# EAGLE design edlinv (EAGLE 7.4.0)
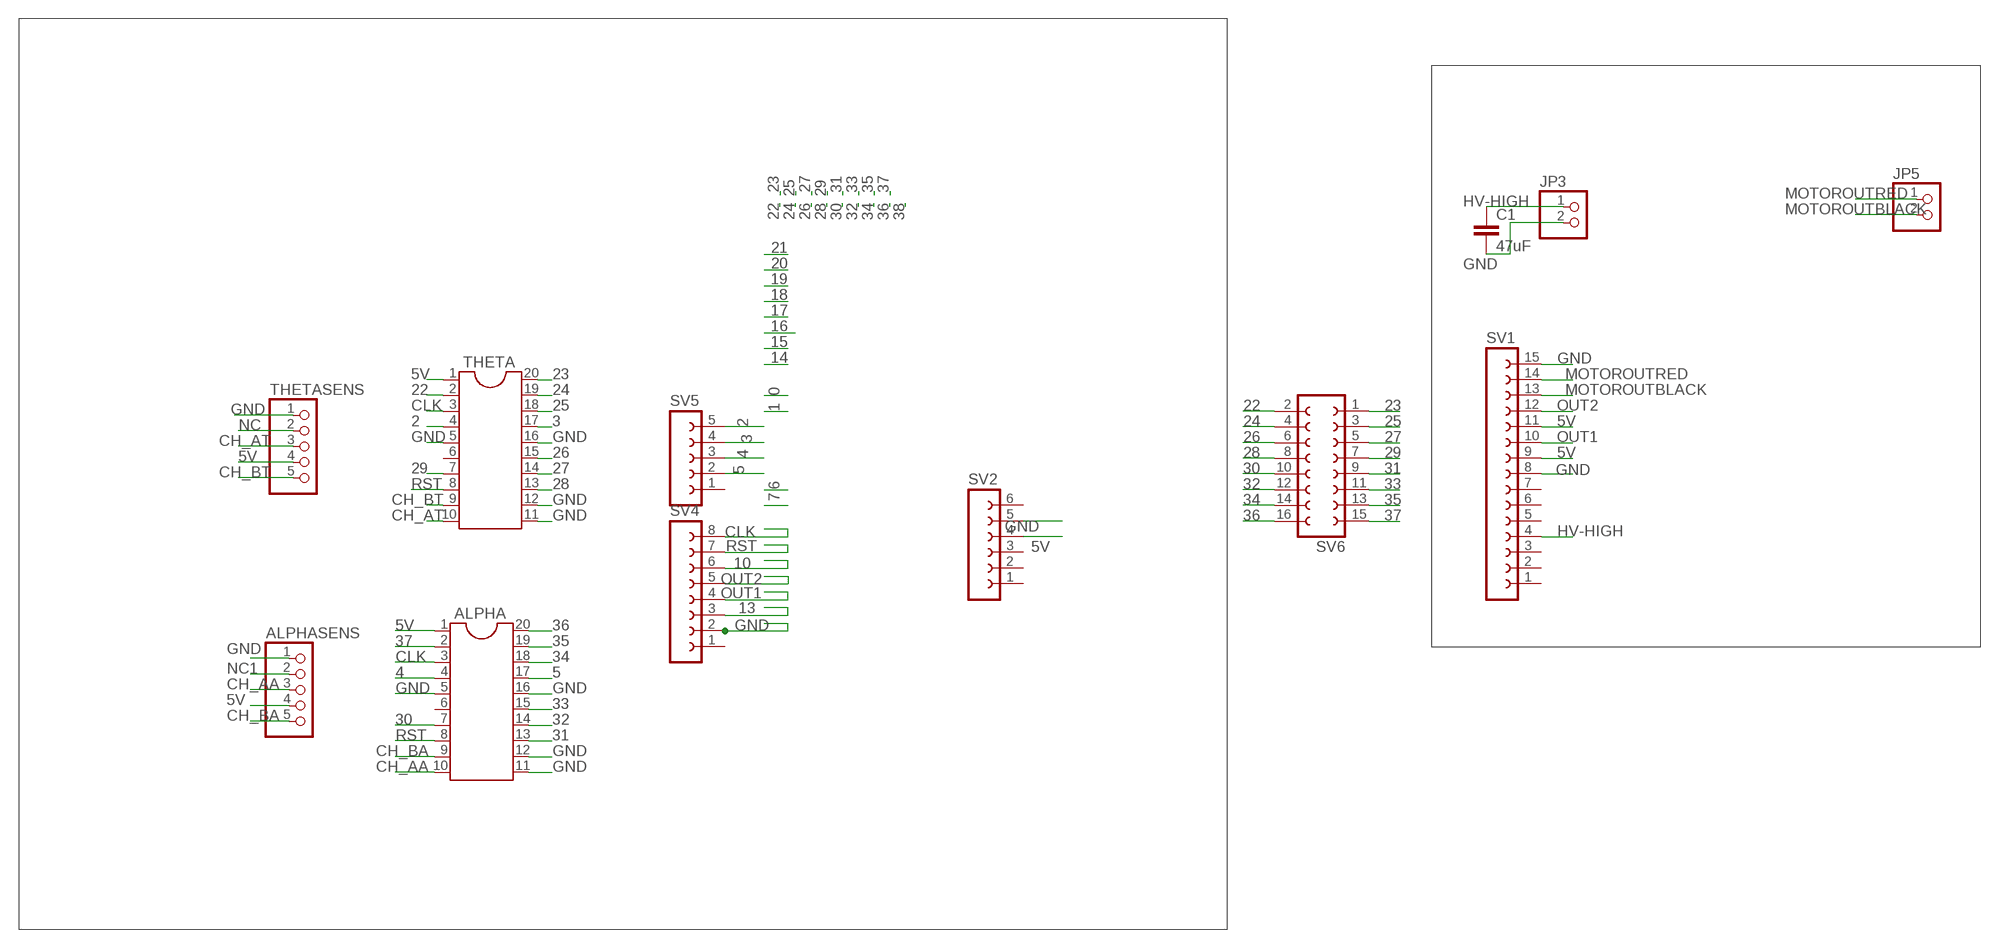
[diagram p0: schematic, sheet 1]

## Parts
ALPHA  DIL20  [DIL20]
ALPHASENS  PINHD-1X5  [1X05]
C1  47uF  C-EU025-025X050  [C025-025X050]
JP3  PINHD-1X2  [1X02]
JP5  PINHD-1X2  [1X02]
SV1  FE15-1  [FE15]
SV2  FE06-1  [FE06]
SV4  FE08-1  [FE08]
SV5  FE05-1  [FE05-1]
SV6  FE08-2  [FE08-2]
THETA  DIL20  [DIL20]
THETASENS  PINHD-1X5  [1X05]

## Nets
2: SV5.5 THETA.4
3: SV5.4 THETA.17
4: ALPHA.4 SV5.3
5: ALPHA.17 SV5.2
5V: ALPHA.1 ALPHASENS.4 SV1.9 SV1.11 SV2.4 THETA.1 THETASENS.4
10: SV4.6
13: SV4.3
22: SV6.2 THETA.2
23: SV6.1 THETA.20
24: SV6.4 THETA.19
25: SV6.3 THETA.18
26: SV6.6 THETA.15
27: SV6.5 THETA.14
28: SV6.8 THETA.13
29: SV6.7 THETA.7
30: ALPHA.7 SV6.10
31: ALPHA.13 SV6.9
32: ALPHA.14 SV6.12
33: ALPHA.15 SV6.11
34: ALPHA.18 SV6.14
35: ALPHA.19 SV6.13
36: ALPHA.20 SV6.16
37: ALPHA.2 SV6.15
CH_AA: ALPHA.10 ALPHASENS.3
CH_AT: THETA.10 THETASENS.3
CH_BA: ALPHA.9 ALPHASENS.5
CH_BT: THETA.9 THETASENS.5
CLK: ALPHA.3 SV4.8 THETA.3
GND: ALPHA.5 ALPHA.11 ALPHA.12 ALPHA.16 ALPHASENS.1 C1.2 JP3.2 SV1.8 SV1.15 SV2.5 SV4.2 THETA.5 THETA.11 THETA.12 THETA.16 THETASENS.1
HV-HIGH: C1.1 JP3.1 SV1.4
MOTOROUTBLACK: JP5.2 SV1.13
MOTOROUTRED: JP5.1 SV1.14
NC: THETASENS.2
NC1: ALPHASENS.2
OUT1: SV1.10 SV4.4
OUT2: SV1.12 SV4.5
RST: ALPHA.8 SV4.7 THETA.8
Unconnected: ALPHA.6 SV1.1 SV1.2 SV1.3 SV1.5 SV1.6 SV1.7 SV2.1 SV2.2 SV2.3 SV2.6 SV4.1 SV5.1 THETA.6

## Library data of the parts
ALPHA THETA = ic-package:DIL20: Dual In Line / Socket
ALPHASENS THETASENS = pinhead:PINHD-1X5: PIN HEADER
C1 = rcl:C-EU: CAPACITOR, European symbol
JP3 JP5 = pinhead:PINHD-1X2: PIN HEADER
SV1 = con-lsta:FE15-1: FEMALE HEADER; OC_FARNELL: unknown; OC_NEWARK: unknown
SV2 = con-lsta:FE06-1: FEMALE HEADER; OC_FARNELL: unknown; OC_NEWARK: unknown
SV4 = con-lsta:FE08-1: FEMALE HEADER; OC_FARNELL: unknown; OC_NEWARK: unknown
SV5 = con-lsta:FE05-1: FEMALE HEADER; OC_FARNELL: unknown; OC_NEWARK: unknown
SV6 = con-lsta:FE08-2: FEMALE HEADER; OC_FARNELL: unknown; OC_NEWARK: unknown

## Board
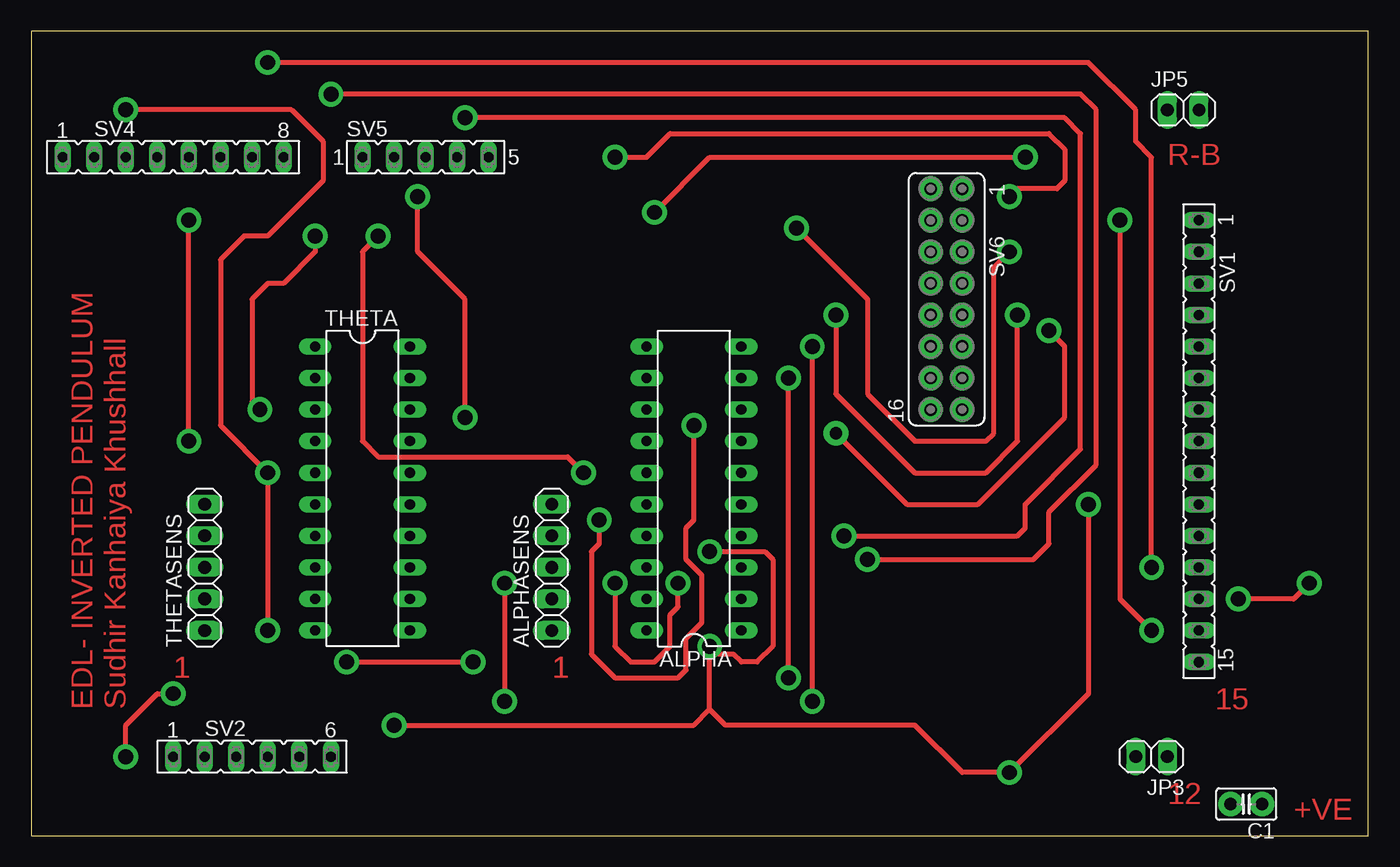
[diagram p1: board, top side]
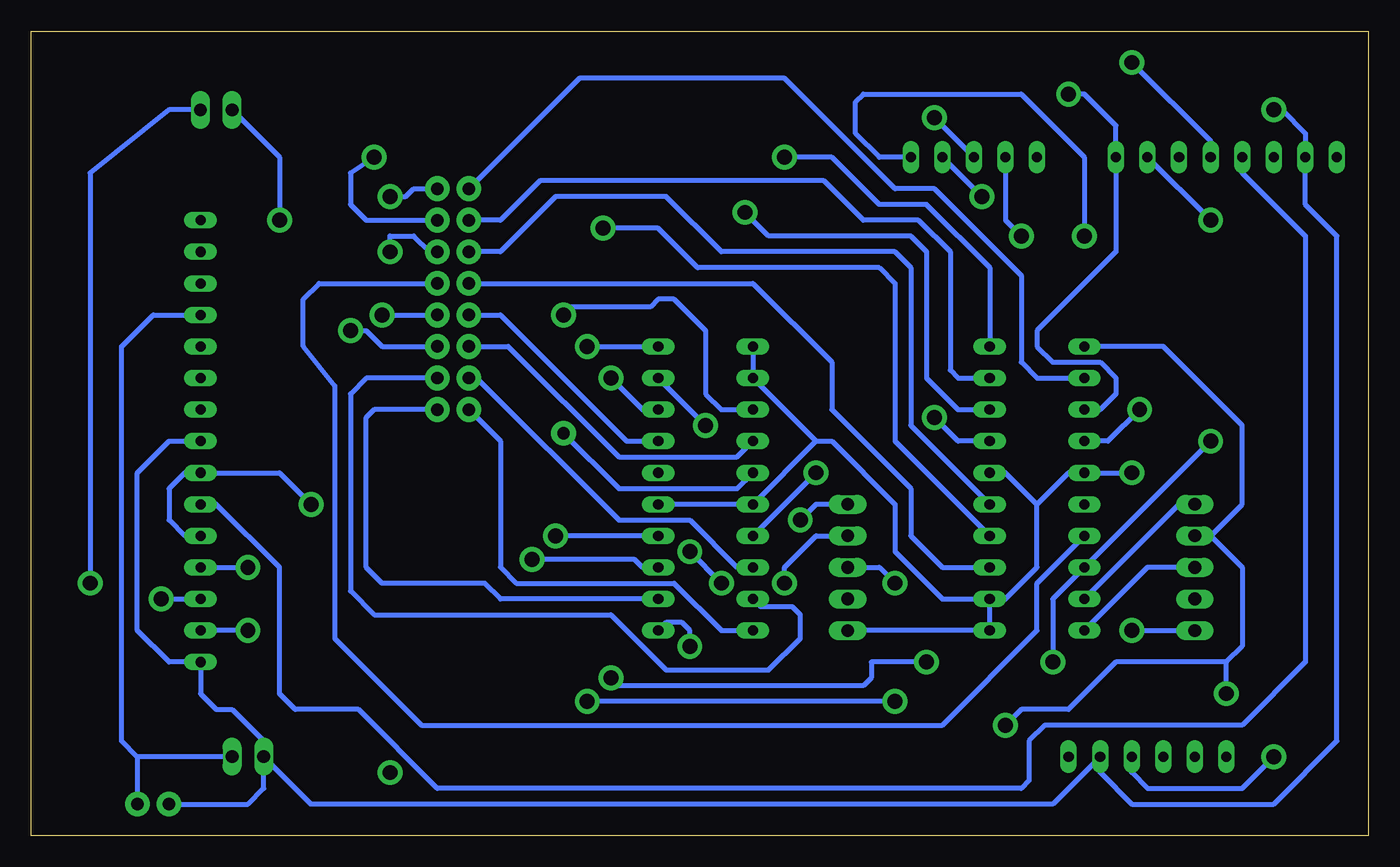
[diagram p2: board, bottom side, seen from below]

Size 107.62 x 64.76 mm. Coordinates in mm from the lower left corner, seen from the top.
Outline: 0,0 107.62,0 107.62,64.76 0,64.76 0,0
Copper layers (1*16): Top 0.035mm / dielectric 1.5mm / Bottom 0.035mm
Design rules "default": minimum track width 10mil, minimum drill 24mil, track to track 8mil, track to pad 8mil, pad to pad 8mil, via to via 8mil, smd to smd 8mil, copper to edge 40mil, drill to drill 8mil, minimum pad ring 10mil, minimum via ring 8mil, stop-mask expansion 4mil, vias tented up to drill 0mil, thermal gap 10mil

### Footprints (pad centres in the part's own frame; a part is rotated, then mirrored left to right if it is on the bottom)
DIL20 = drill 0.813 long: 1 -11.43,-3.81; 2 -8.89,-3.81; 3 -6.35,-3.81; 4 -3.81,-3.81; 5 -1.27,-3.81; 6 1.27,-3.81; 7 3.81,-3.81; 8 6.35,-3.81; 9 8.89,-3.81; 10 11.43,-3.81; 11 11.43,3.81; 12 8.89,3.81; 13 6.35,3.81; 14 3.81,3.81; 15 1.27,3.81; 16 -1.27,3.81; 17 -3.81,3.81; 18 -6.35,3.81; 19 -8.89,3.81; 20 -11.43,3.81
1X05 = drill 1.016 long: 1 -5.08,0; 2 -2.54,0; 3 0,0; 4 2.54,0; 5 5.08,0
C025-025X050 = drill 1 pad 2: 1 -1.27,0; 2 1.27,0
1X02 = drill 1.016 long: 1 -1.27,0; 2 1.27,0
FE15 = drill 0.813 long: 1 -17.78,0; 2 -15.24,0; 3 -12.7,0; 4 -10.16,0; 5 -7.62,0; 6 -5.08,0; 7 -2.54,0; 8 0,0; 9 2.54,0; 10 5.08,0; 11 7.62,0; 12 10.16,0; 13 12.7,0; 14 15.24,0; 15 17.78,0
FE06 = drill 0.813 long: 1 -6.35,0; 2 -3.81,0; 3 -1.27,0; 4 1.27,0; 5 3.81,0; 6 6.35,0
FE08 = drill 0.813 long: 1 -8.89,0; 2 -6.35,0; 3 -3.81,0; 4 -1.27,0; 5 1.27,0; 6 3.81,0; 7 6.35,0; 8 8.89,0
FE05-1 = drill 0.813 long: 1 -5.08,0; 2 -2.54,0; 3 0,0; 4 2.54,0; 5 5.08,0
FE08-2 = drill 1 pad 2: 1 -8.89,1.27; 2 -8.89,-1.27; 3 -6.35,1.27; 4 -6.35,-1.27; 5 -3.81,1.27; 6 -3.81,-1.27; 7 -1.27,1.27; 8 -1.27,-1.27; 9 1.27,1.27; 10 1.27,-1.27; 11 3.81,1.27; 12 3.81,-1.27; 13 6.35,1.27; 14 6.35,-1.27; 15 8.89,1.27; 16 8.89,-1.27

### Placement (x,y rotation side)
ALPHA  53.34,27.94 90 top
ALPHASENS  41.91,21.59 90 top
C1  97.79,2.54 180 top
JP3  90.17,6.35 180 top
JP5  92.71,58.42 0 top
SV1  93.98,31.75 270 top
SV2  17.78,6.35 0 top
SV4  11.43,54.61 0 top
SV5  31.75,54.61 0 top
SV6  73.66,43.18 270 top
THETA  26.67,27.94 270 top
THETASENS  13.97,21.59 90 top

### Tracks (layer width: path | path; a pad name or v marks a point on that pad's centre or on a via)
2  (via drill 1.2 pad 2)
  Top 0.406: v22.86,48.26 22.86,46.99 20.32,44.45 19.05,44.45 17.78,43.18 17.78,34.92 v18.41,34.29
  Bottom 0.406: v22.86,48.26 22.86,54.61 27.94,59.69 40.64,59.69 41.28,59.05 41.28,56.52 39.37,54.61 SV5.5 | v18.41,34.29 20.95,31.75 THETA.4
3  (via drill 1.2 pad 2)
  Top 0.406: v34.92,33.66 34.92,43.18 31.12,46.99 v31.12,51.44
  Bottom 0.406: v31.12,51.44 SV5.4 | THETA.17 33.02,31.75 v34.92,33.66
4  (via drill 1.2 pad 2)
  Top 0.406: v34.92,57.78 83.19,57.78 84.45,56.52 84.45,31.12 80.01,26.67 80.01,24.77 79.38,24.13 v65.41,24.13
  Bottom 0.406: ALPHA.4 v65.41,24.13 | v34.92,57.78 SV5.3
5  (via drill 1.2 pad 2)
  Top 0.406: v27.94,48.26 26.67,46.99 26.67,31.75 27.94,30.48 43.18,30.48 v44.45,29.21
  Bottom 0.406: SV5.2 29.21,49.53 v27.94,48.26 | v44.45,29.21 ALPHA.17
5V  (via drill 1.2 pad 2)
  Top 0.406: v29.21,8.89 53.34,8.89 54.61,10.16 | 54.61,10.16 v54.61,15.24 55.25,14.61 56.52,14.61 57.15,13.97 58.42,13.97 59.69,15.24 59.69,22.22 59.06,22.86 v54.61,22.86 | v85.09,26.67 85.09,11.43 v78.74,5.08 74.93,5.08 71.12,8.89 55.88,8.89 54.61,10.16 | v7.62,6.35 7.62,8.89 10.16,11.43 v11.43,11.43 | v46.99,20.32 46.99,15.24 48.26,13.97 50.17,13.97 51.44,15.24 51.44,17.78 52.07,18.41 v52.07,20.32
  Bottom 0.406: 12.7,24.13 10.16,21.59 10.16,15.24 11.43,13.97 | 11.43,13.97 20.32,13.97 24.13,10.16 27.94,10.16 v29.21,8.89 | THETASENS.4 12.7,24.13 | 12.7,24.13 10.16,26.67 10.16,33.02 16.51,39.37 THETA.1 | v46.99,20.32 46.99,21.59 44.45,24.13 ALPHASENS.4 | v54.61,15.24 54.61,16.51 55.25,17.14 56.52,17.14 ALPHA.1 | v85.09,26.67 87.63,29.21 SV1.9 95.25,29.21 96.52,27.94 96.52,25.4 95.25,24.13 SV1.11 | SV2.4 19.05,5.08 17.78,3.81 10.16,3.81 v7.62,6.35 | v11.43,11.43 11.43,13.97 | v52.07,20.32 v54.61,22.86
22
  Bottom 0.406: THETA.2 26.67,36.83 27.94,38.1 27.94,45.09 34.92,52.07 38.1,52.07 46.99,60.96 63.5,60.96 SV6.2
23  (via drill 1.2 pad 2)
  Top 0.406: v46.99,54.61 49.53,54.61 51.44,56.52 81.92,56.52 83.19,55.25 83.19,52.7 82.55,52.07 79.38,52.07 v78.74,51.44
  Bottom 0.406: THETA.20 30.48,45.72 35.56,50.8 39.37,50.8 43.18,54.61 v46.99,54.61 | v78.74,51.44 77.47,51.44 76.83,52.07 SV6.1
24
  Bottom 0.406: THETA.19 33.02,36.83 33.66,37.46 33.66,46.99 36.2,49.53 40.64,49.53 43.81,52.7 66.67,52.7 69.85,49.53 SV6.4
25  (via drill 1.2 pad 2)
  Top 0.406: v50.17,50.16 54.61,54.61 v80.01,54.61
  Bottom 0.406: THETA.18 33.02,34.29 35.56,36.83 35.56,46.99 36.83,48.26 48.26,48.26 v50.17,50.16 | v80.01,54.61 81.92,53.34 81.92,50.8 80.64,49.53 SV6.3
26
  Bottom 0.406: THETA.15 36.83,33.02 36.83,45.72 38.1,46.99 52.07,46.99 56.52,51.44 65.41,51.44 69.85,46.99 SV6.6
27  (via drill 1.2 pad 2)
  Top 0.406: v61.59,48.89 67.31,43.18 67.31,35.56 71.12,31.75 76.83,31.75 77.47,32.38 77.47,45.72 v78.74,46.99
  Bottom 0.406: THETA.14 38.1,31.75 38.1,44.45 39.37,45.72 53.97,45.72 57.15,48.89 v61.59,48.89 | v78.74,46.99 78.74,48.26 76.83,48.26 75.56,46.99 SV6.5
28
  Bottom 0.406: SV6.8 49.53,44.45 43.18,38.1 43.18,34.29 36.83,27.94 36.83,24.13 34.29,21.59 THETA.13
29
  Bottom 0.406: THETA.7 26.67,20.32 26.67,16.51 34.29,8.89 76.2,8.89 83.19,15.88 83.19,36.2 85.72,39.37 85.72,43.18 84.45,44.45 SV6.7
30
  Bottom 0.406: SV6.10 69.85,41.91 59.69,31.75 ALPHA.7
31  (via drill 1.2 pad 2)
  Top 0.406: v64.77,41.91 64.77,35.56 71.12,29.21 76.83,29.21 79.38,31.75 v79.38,41.91
  Bottom 0.406: ALPHA.13 52.07,34.29 53.34,35.56 53.34,40.64 55.88,43.18 57.15,43.18 57.78,42.55 64.14,42.55 v64.77,41.91 | v79.38,41.91 SV6.9
32
  Bottom 0.406: SV6.12 69.22,39.37 60.33,30.48 50.8,30.48 ALPHA.14
33  (via drill 1 pad 2, 1.2 pad 2)
  Top 0.406: v81.92,40.64 83.19,39.37 83.19,33.66 76.2,26.67 70.48,26.67 v64.77,32.38
  Bottom 0.406: ALPHA.15 50.8,27.94 60.33,27.94 v64.77,32.38 | v81.92,40.64 80.64,40.64 79.38,39.37 SV6.11
34
  Bottom 0.406: SV6.14 71.75,36.83 60.33,25.4 54.61,25.4 50.8,21.59 ALPHA.18
35
  Bottom 0.406: SV6.13 80.64,36.83 81.92,35.56 81.92,19.68 80.01,17.78 60.96,17.78 56.52,13.34 48.26,13.34 45.72,15.88 45.72,17.78 46.36,18.41 48.89,18.41 ALPHA.19
36
  Bottom 0.406: SV6.16 69.85,31.75 69.85,21.59 68.58,20.32 55.88,20.32 52.07,16.51 ALPHA.20
37
  Bottom 0.406: ALPHA.2 69.85,19.05 71.12,20.32 79.38,20.32 80.64,21.59 80.64,33.66 80.01,34.29 SV6.15
CH_AA  (via drill 1.2 pad 2)
  Top 0.406: v38.1,20.32 v38.1,10.79 | v62.86,10.79 v62.86,39.37
  Bottom 0.406: ALPHASENS.3 39.37,21.59 v38.1,20.32 | v38.1,10.79 v62.86,10.79 | v62.86,39.37 ALPHA.10
CH_AT
  Bottom 0.406: THETASENS.3 17.78,21.59 THETA.10
CH_BA  (via drill 1.2 pad 2)
  Top 0.406: v53.34,33.02 53.34,25.4 52.7,24.77 52.7,22.22 53.97,20.95 53.97,17.14 52.7,15.88 52.7,13.34 52.07,12.7 46.99,12.7 45.08,14.61 45.08,22.86 45.72,23.49 v45.72,25.4
  Bottom 0.406: ALPHASENS.5 44.45,26.67 v45.72,25.4 | v53.34,33.02 ALPHA.9
CH_BT
  Bottom 0.406: THETASENS.5 15.24,26.67 THETA.9
CLK  (via drill 1.2 pad 2)
  Top 0.406: v24.13,59.69 84.45,59.69 85.72,58.42 85.72,29.84 81.92,26.03 81.92,23.49 80.64,22.22 v67.31,22.22
  Bottom 0.406: THETA.3 21.59,34.29 20.32,35.56 20.32,36.83 21.59,38.1 25.4,38.1 26.67,39.37 26.67,40.64 20.32,46.99 SV4.8 20.32,57.15 22.86,59.69 v24.13,59.69 | ALPHA.3 58.42,21.59 59.06,22.22 v67.31,22.22
GND  (via drill 1.2 pad 2)
  Top 0.406: v19.05,16.51 v19.05,29.21 15.24,33.02 15.24,46.35 17.15,48.26 19.05,48.26 23.49,52.7 23.49,55.88 20.95,58.42 v7.62,58.42
  Bottom 0.406: ALPHA.5 ALPHA.16 44.45,31.75 | ALPHA.11 ALPHA.12 44.45,31.75 | ALPHASENS.1 THETA.11 THETA.12 | THETA.12 29.21,19.05 26.67,21.59 26.67,26.67 | 26.67,26.67 24.13,29.21 THETA.5 v19.05,29.21 | THETA.16 29.21,29.21 26.67,26.67 | 44.45,31.75 43.18,31.75 38.1,26.67 38.1,22.86 34.29,19.05 THETA.12 | JP3.2 88.9,7.62 91.44,10.16 92.71,10.16 93.98,11.43 SV1.15 96.52,13.97 99.06,16.51 99.06,29.21 96.52,31.75 SV1.8 | JP3.2 85.09,2.54 25.4,2.54 SV2.5 21.59,5.08 19.05,2.54 7.62,2.54 2.54,7.62 2.54,48.26 5.08,50.8 SV4.2 5.08,56.52 6.98,58.42 v7.62,58.42 | C1.2 90.17,2.54 88.9,3.81 JP3.2 | v19.05,16.51 THETASENS.1
HV-HIGH
  Bottom 0.406: JP3.1 99.06,6.35 | 99.06,6.35 100.33,7.62 100.33,39.37 97.79,41.91 SV1.4 | 99.06,6.35 C1.1
MOTOROUTBLACK  (via drill 1.2 pad 2)
  Top 0.406: v102.87,20.32 101.6,19.05 v97.16,19.05
  Bottom 0.406: JP5.2 96.52,58.42 102.87,53.34 v102.87,20.32 | v97.16,19.05 SV1.13
MOTOROUTRED  (via drill 1.2 pad 2)
  Top 0.406: v87.63,49.53 87.63,19.05 v90.17,16.51
  Bottom 0.406: v90.17,16.51 SV1.14 | JP5.1 87.63,54.61 v87.63,49.53
OUT1
  Bottom 0.406: SV4.4 10.16,53.34 5.08,48.26 5.08,13.97 10.16,8.89 26.04,8.89 27.3,7.62 27.3,4.45 27.94,3.81 74.93,3.81 81.28,10.16 86.36,10.16 87.63,11.43 87.63,21.59 92.71,26.67 SV1.10
OUT2  (via drill 1.2 pad 2)
  Top 0.406: v90.17,21.59 90.17,54.61 88.9,55.88 88.9,58.42 85.09,62.23 v19.05,62.23
  Bottom 0.406: SV1.12 v90.17,21.59 | v19.05,62.23 12.7,55.88 SV4.5
RST  (via drill 1.2 pad 2)
  Top 0.406: v12.7,31.75 v12.7,49.53 | v25.4,13.97 v35.56,13.97 | v60.96,12.7 v60.96,36.83
  Bottom 0.406: v12.7,31.75 THETA.8 25.4,19.05 v25.4,13.97 | v35.56,13.97 40.01,13.97 40.01,12.7 40.64,12.06 60.33,12.06 v60.96,12.7 | v60.96,36.83 58.42,34.29 ALPHA.8 | v12.7,49.53 SV4.7

### Text on the board
Top: R-B | 1 | 1 | 1 | EDL- INVERTED PENDULUM / Sudhir Kanhaiya Khushhall | 15 | 12 | +VE